# Altium schematic sheet Relay_switcher.SchDoc
size A4; SheetNumber: 3; SheetTotal: 5
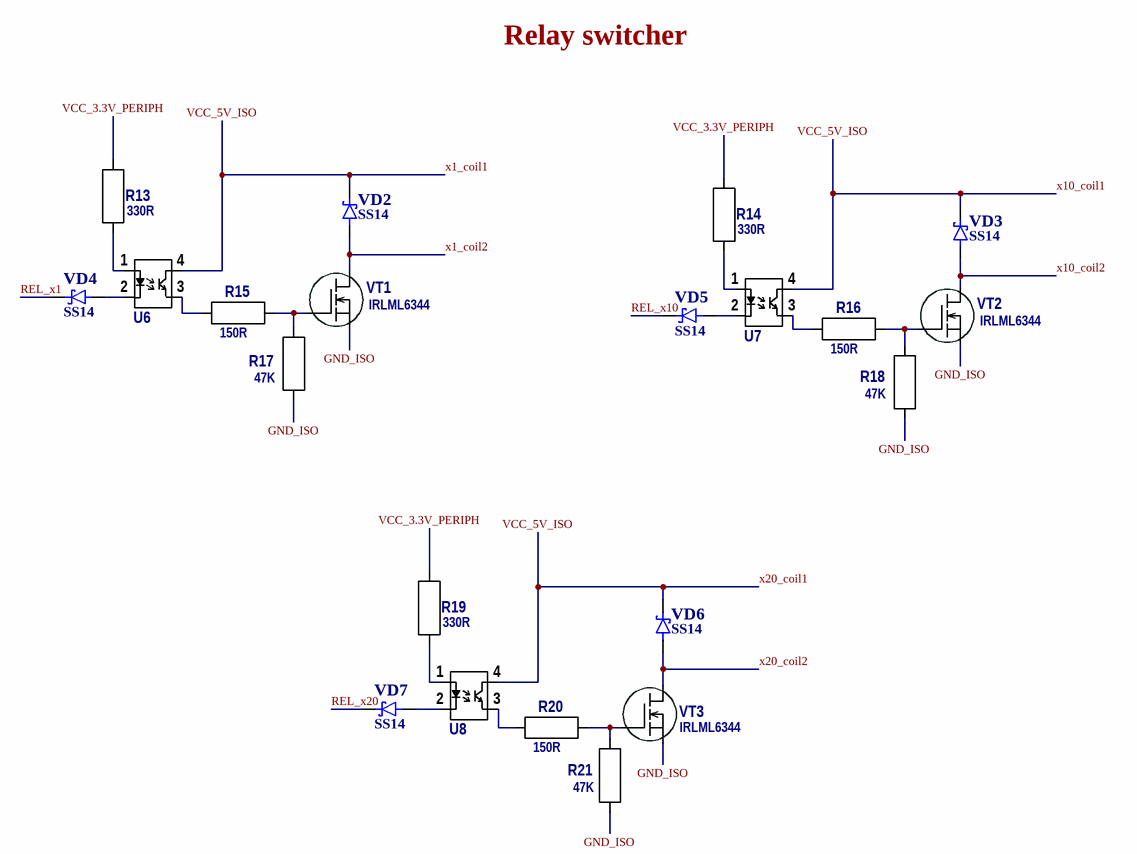
[diagram p0: Relay_switcher.SchDoc]

## Parts
R13  330R  [Res_1206 3D]
R14  330R  [Res_1206 3D]
R15  150R  [Res_1206 3D]
R16  150R  [Res_1206 3D]
R17  47K  [Res_1206 3D]
R18  47K  [Res_1206 3D]
R19  330R  [Res_1206 3D]
R20  150R  [Res_1206 3D]
R21  47K  [Res_1206 3D]
U6  Optocoupler EL817 DIP-4  [DIP-4]  (value not drawn)
U7  Optocoupler EL817 DIP-4  [DIP-4]  (value not drawn)
U8  Optocoupler EL817 DIP-4  [DIP-4]  (value not drawn)
VD2  SS14  [SMA]
VD3  SS14  [SMA]
VD4  SS14  [SMA]
VD5  SS14  [SMA]
VD6  SS14  [SMA]
VD7  SS14  [SMA]
VT1  IRLML6344  [SOT-23-3]
VT2  IRLML6344  [SOT-23-3]
VT3  IRLML6344  [SOT-23-3]

## Nets
GND_ISO: R17.2 R18.2 R21.2 VT1.3(S) VT2.3(S) VT3.3(S)
REL_x1: VD4.P2(C)
REL_x10: VD5.P2(C)
REL_x20: VD7.P2(C)
VCC_3.3V_PERIPH: R13.2 R14.2 R19.2
VCC_5V_ISO: U6.4(C) U7.4(C) U8.4(C) VD2.P2(C) VD3.P2(C) VD6.P2(C)  [also labelled x10_coil1, x1_coil1, x20_coil1]
x1_coil2: VD2.P1(A) VT1.2(D)
x10_coil2: VD3.P1(A) VT2.2(D)
x20_coil2: VD6.P1(A) VT3.2(D)
NetR13_1: R13.1 U6.1(Led_A)
NetR14_1: R14.1 U7.1(Led_A)
NetR15_1: R15.1 U6.3(E)
NetR15_2: R15.2 R17.1 VT1.1(G)
NetR16_1: R16.1 U7.3(E)
NetR16_2: R16.2 R18.1 VT2.1(G)
NetR19_1: R19.1 U8.1(Led_A)
NetR20_1: R20.1 U8.3(E)
NetR20_2: R20.2 R21.1 VT3.1(G)
NetU6_2: U6.2(Led_C) VD4.P1(A)
NetU7_2: U7.2(Led_C) VD5.P1(A)
NetU8_2: U8.2(Led_C) VD7.P1(A)

## Notes on the sheet
- Relay switcher

## Library data of the parts
R13-R21 = R
U6-U8 = EL817: Оптрон выход - транзистор
VD2-VD7 = SS14: Diode Schottky 40 V 1A Surface Mount DO-214AC (SMA); MF: ON; SnapEDA_Link: https://www.snapeda.com/parts/SS14/Onsemi/view-part/?ref=snap; Package: SMA-2 ON Semiconductor; Value: *; MP: SS14; Check_prices: https://www.snapeda.com/parts/SS14/Onsemi/view-part/?ref=eda
VT1-VT3 = VT MOSFET-N: Транзистор MOSFET N-канал IRLML6344